# Altium schematic sheet Sheet1.SchDoc
size A2; SheetNumber: 1; SheetTotal: 1
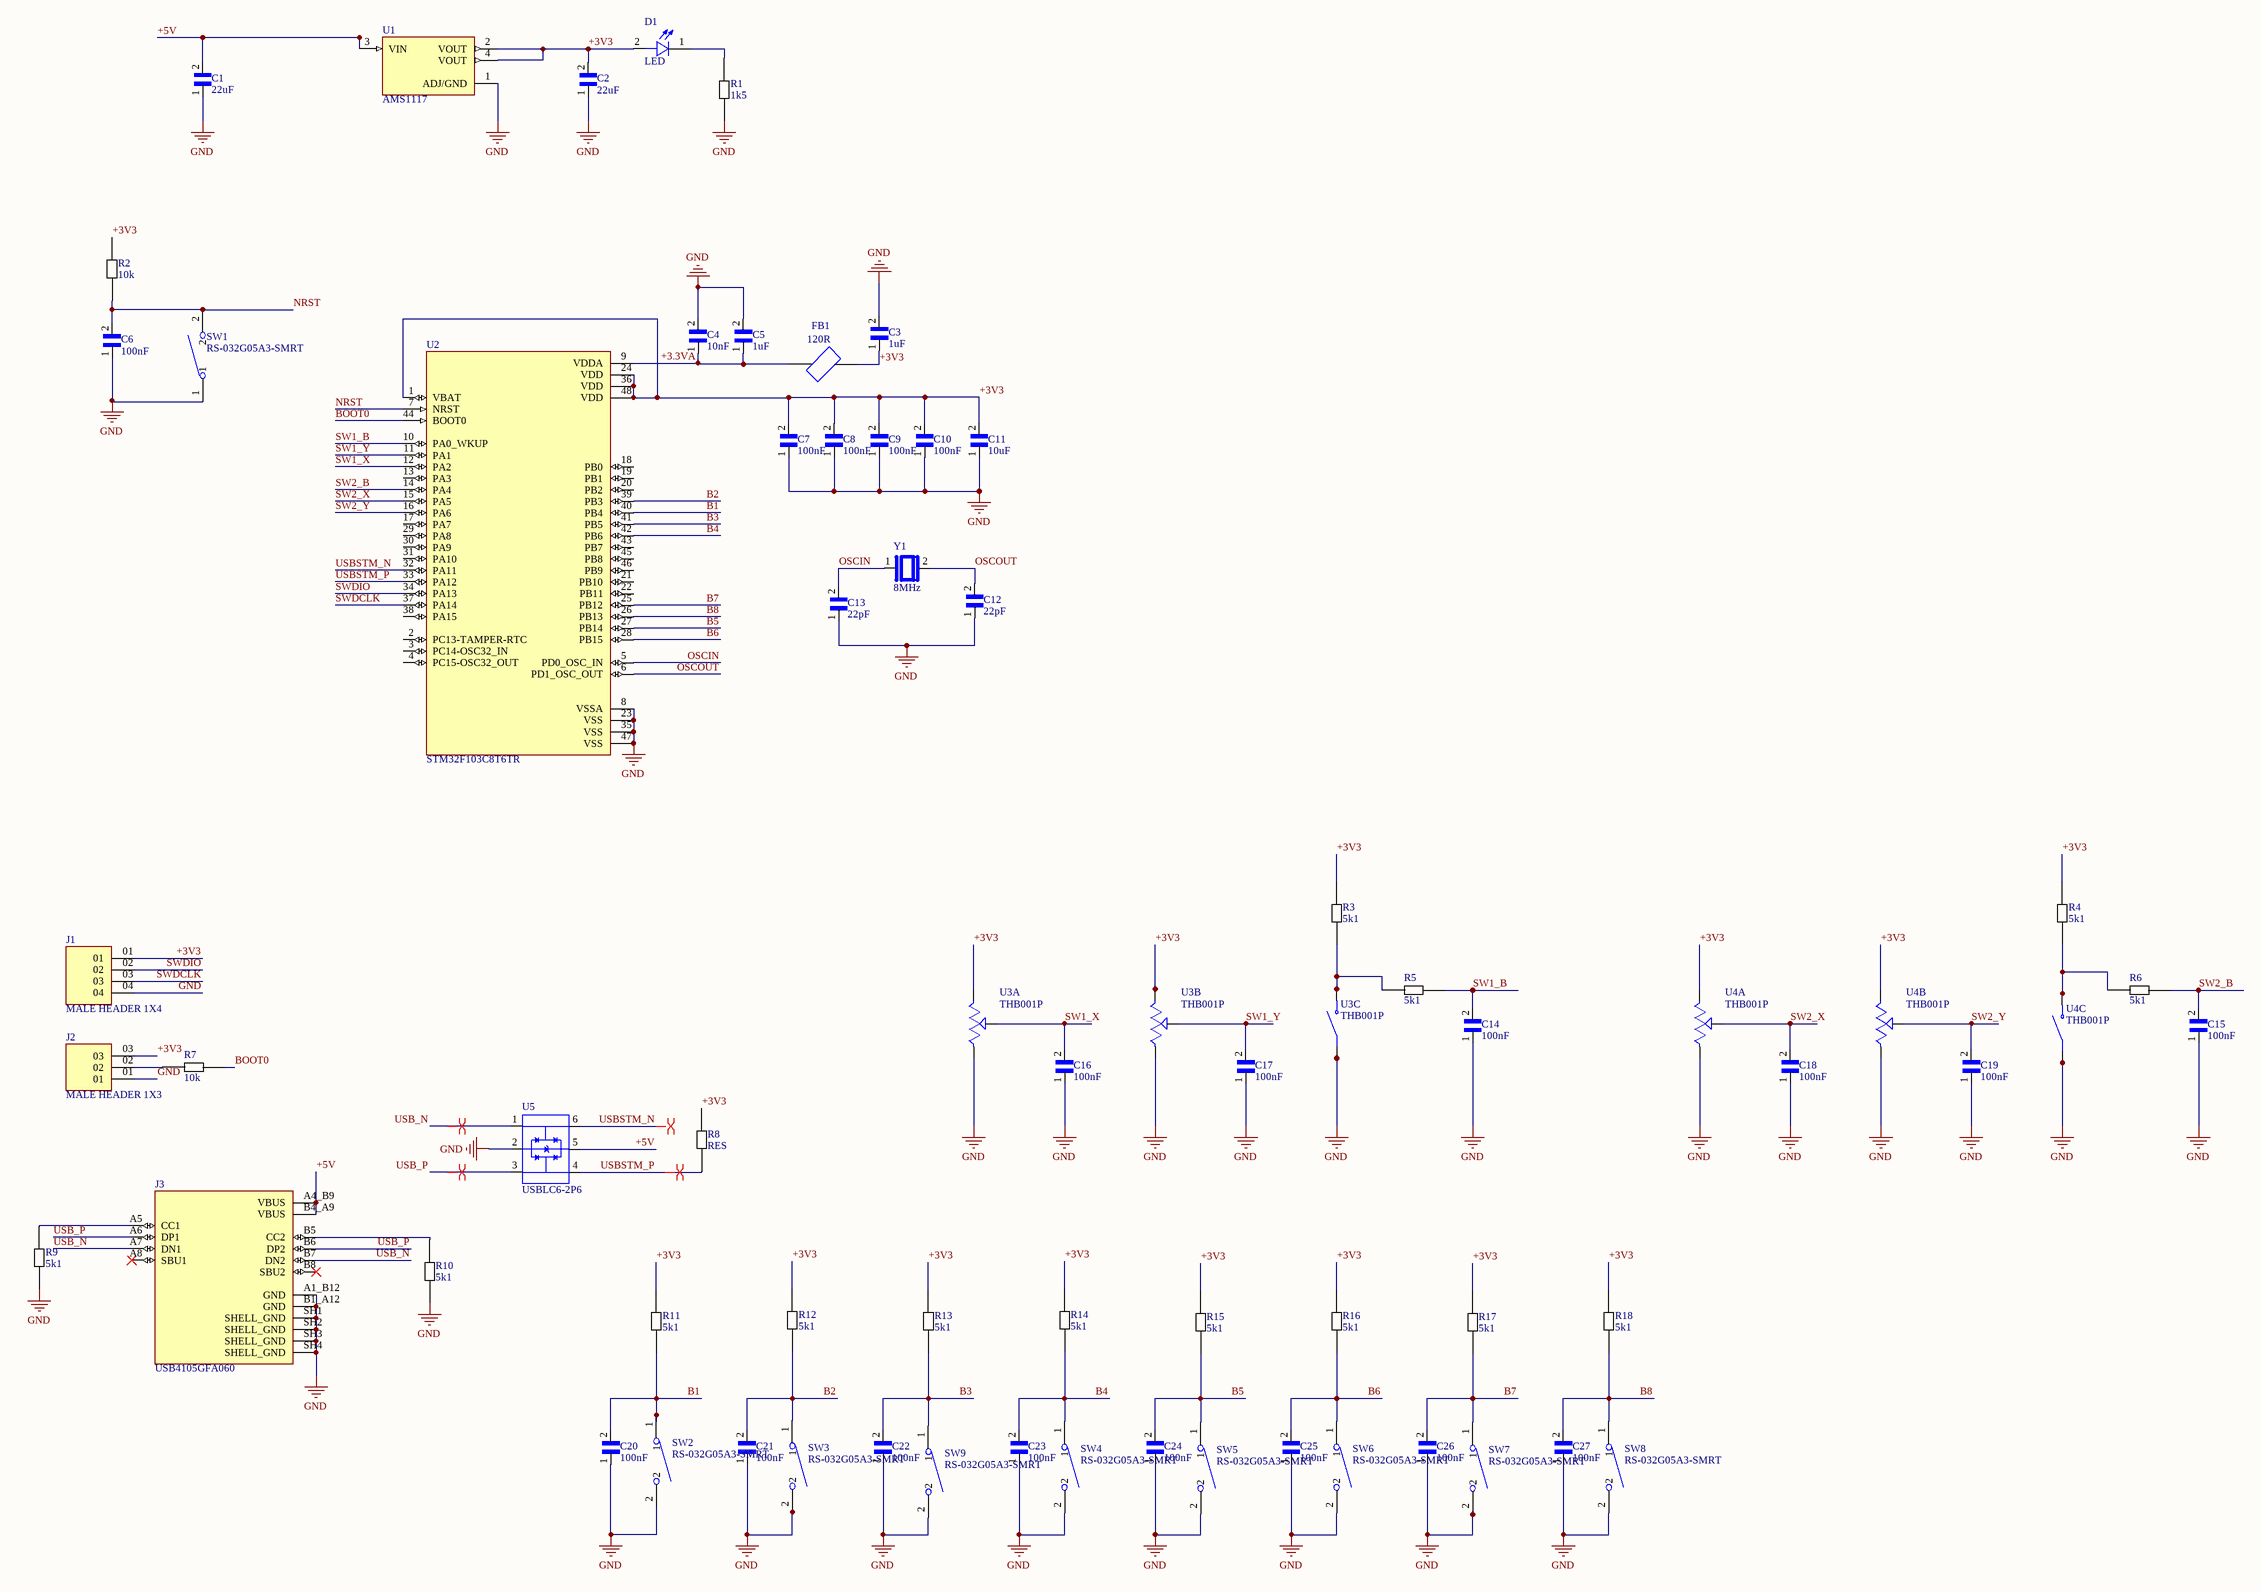
[diagram p0: Sheet1.SchDoc]

## Parts
C1  22uF  [CAPC2012X94N]
C2  22uF  [CAPC2012X94N]
C3  1uF  [CAPC2012X94N]
C4  10nF  [CAPC2012X94N]
C5  1uF  [CAPC2012X94N]
C6  100nF  [CAPC2012X94N]
C7  100nF  [CAPC2012X94N]
C8  100nF  [CAPC2012X94N]
C9  100nF  [CAPC2012X94N]
C10  100nF  [CAPC2012X94N]
C11  10uF  [CAPC2012X94N]
C12  22pF  [CAPC2012X94N]
C13  22pF  [CAPC2012X94N]
C14  100nF  [CAPC2012X94N]
C15  100nF  [CAPC2012X94N]
C16  100nF  [CAPC2012X94N]
C17  100nF  [CAPC2012X94N]
C18  100nF  [CAPC2012X94N]
C19  100nF  [CAPC2012X94N]
C20  100nF  [CAPC2012X94N]
C21  100nF  [CAPC2012X94N]
C22  100nF  [CAPC2012X94N]
C23  100nF  [CAPC2012X94N]
C24  100nF  [CAPC2012X94N]
C25  100nF  [CAPC2012X94N]
C26  100nF  [CAPC2012X94N]
C27  100nF  [CAPC2012X94N]
D1  LED  [LED_V0805-SMD-R (Red)]
FB1  120R  [FB_MI0805K400R-10]
J1  MALE HEADER 1X4  [SAMTEC_MTLW-104-X-X-S-X]
J2  MALE HEADER 1X3  [SAMTEC_MTLW-103-XX-XX-S-XXX]
J3  USB4105GFA060  [GCT_USB4105GFA060]
R1  1k5  [RESC2012X60N]
R2  10k  [RESC2012X60N]
R3  5k1  [RESC2012X60N]
R4  5k1  [RESC2012X60N]
R5  5k1  [RESC2012X60N]
R6  5k1  [RESC2012X60N]
R7  10k  [RESC2012X60N]
R8  RES  [RESC2012X60N]
R9  5k1  [RESC2012X60N]
R10  5k1  [RESC2012X60N]
R11  5k1  [RESC2012X60N]
R12  5k1  [RESC2012X60N]
R13  5k1  [RESC2012X60N]
R14  5k1  [RESC2012X60N]
R15  5k1  [RESC2012X60N]
R16  5k1  [RESC2012X60N]
R17  5k1  [RESC2012X60N]
R18  5k1  [RESC2012X60N]
SW1  RS-032G05A3-SMRT  [SW_RS-032G05A3-SMRT]
SW2  RS-032G05A3-SMRT  [SW_RS-032G05A3-SMRT]
SW3  RS-032G05A3-SMRT  [SW_RS-032G05A3-SMRT]
SW4  RS-032G05A3-SMRT  [SW_RS-032G05A3-SMRT]
SW5  RS-032G05A3-SMRT  [SW_RS-032G05A3-SMRT]
SW6  RS-032G05A3-SMRT  [SW_RS-032G05A3-SMRT]
SW7  RS-032G05A3-SMRT  [SW_RS-032G05A3-SMRT]
SW8  RS-032G05A3-SMRT  [SW_RS-032G05A3-SMRT]
SW9  RS-032G05A3-SMRT  [SW_RS-032G05A3-SMRT]
U1  AMS1117  [SOT229P700X180-4N]
U2  STM32F103C8T6TR  [QFP50P900X900X160-48N]
U3  THB001P  [CNK_THB001P]  (parts A,B,C of 3)
U4  THB001P  [CNK_THB001P]  (parts A,B,C of 3)
U5  USBLC6-2P6  [SOT50P160X60-6N]
Y1  8MHz  [XTAL_HC49P488W43L1150T466H350]

## Nets
GND: C1.1 C2.1 C3.2 C4.2 C5.2 C6.1 C7.1 C8.1 C9.1 C10.1 C11.1 C12.1 C13.1 C14.1 C15.1 C16.1 C17.1 C18.1 C19.1 C20.1 C21.1 C22.1 C23.1 C24.1 C25.1 C26.1 C27.1 J1.04 J2.01 J3.A1_B12(GND) J3.B1_A12(GND) J3.SH1(SHELL_GND) J3.SH2(SHELL_GND) J3.SH3(SHELL_GND) J3.SH4(SHELL_GND) R1.1 R9.1 R10.1 SW1.1 SW2.2 SW3.2 SW4.2 SW5.2 SW6.2 SW7.2 SW8.2 SW9.2 U1.1(ADJ/GND) U2.8(VSSA) U2.23(VSS) U2.35(VSS) U2.47(VSS) U3.C(COM) U3.D(COM) U3.VR1_1 U3.VR2_1 U4.C(COM) U4.D(COM) U4.VR1_1 U4.VR2_1 U5.2(GND)
+3.3VA: C4.1 C5.1 FB1.1 U2.9(VDDA)
+3V3: C2.2 C3.1 C7.2 C8.2 C9.2 C10.2 C11.2 D1.2(A) FB1.2 J1.01 J2.03 R2.2 R3.2 R4.2 R8.2 R11.2 R12.2 R13.2 R14.2 R15.2 R16.2 R17.2 R18.2 U1.2(VOUT) U1.4(VOUT) U2.1(VBAT) U2.24(VDD) U2.36(VDD) U2.48(VDD) U3.VR1_3 U3.VR2_3 U4.VR1_3 U4.VR2_3
+5V: C1.2 J3.A4_B9(VBUS) J3.B4_A9(VBUS) U1.3(VIN) U5.5(VBUS)
B1: C20.2 R11.1 SW2.1 U2.40(PB4)
B2: C21.2 R12.1 SW3.1 U2.39(PB3)
B3: C22.2 R13.1 SW9.1 U2.41(PB5)
B4: C23.2 R14.1 SW4.1 U2.42(PB6)
B5: C24.2 R15.1 SW5.1 U2.27(PB14)
B6: C25.2 R16.1 SW6.1 U2.28(PB15)
B7: C26.2 R17.1 SW7.1 U2.25(PB12)
B8: C27.2 R18.1 SW8.1 U2.26(PB13)
BOOT0: R7.2 U2.44(BOOT0)
NRST: C6.2 R2.1 SW1.2 U2.7(NRST)
OSCIN: C13.2 U2.5(PD0_OSC_IN) Y1.1
OSCOUT: C12.2 U2.6(PD1_OSC_OUT) Y1.2
SW1_B: C14.2 R5.1 U2.10(PA0_WKUP)
SW1_X: C16.2 U2.12(PA2) U3.VR1_2
SW1_Y: C17.2 U2.11(PA1) U3.VR2_2
SW2_B: C15.2 R6.1 U2.14(PA4)
SW2_X: C18.2 U2.15(PA5) U4.VR1_2
SW2_Y: C19.2 U2.16(PA6) U4.VR2_2
SWDCLK: J1.03 U2.37(PA14)
SWDIO: J1.02 U2.34(PA13)
USB_N: J3.A7(DN1) J3.B7(DN2) U5.1(I/O1_1)
USB_P: J3.A6(DP1) J3.B6(DP2) U5.3(I/O2_1)
USBSTM_N: U2.32(PA11) U5.6(I/O1_2)
USBSTM_P: R8.1 U2.33(PA12) U5.4(I/O2_2)
NetD1_1: D1.1(C) R1.2
NetJ2_02: J2.02 R7.1
NetJ3_A5: J3.A5(CC1) R9.2
NetJ3_B5: J3.B5(CC2) R10.2
NetR3_1: R3.1 R5.2 U3.A(NO) U3.B(NO)
NetR4_1: R4.1 R6.2 U4.A(NO) U4.B(NO)

Not connected (* = marked no-connect by the designer): J3 A8(SBU1)* B8(SBU2)*; U2 2(PC13-TAMPER-RTC) 3(PC14-OSC32_IN) 4(PC15-OSC32_OUT) 13(PA3) 17(PA7) 18(PB0) 19(PB1) 20(PB2) 21(PB10) 22(PB11) 29(PA8) 30(PA9) 31(PA10) 38(PA15) 43(PB7) 45(PB8) 46(PB9)

## Layout directives
differential pair: USB_N, USB_P, USBSTM_N, USBSTM_P

## Library data of the parts
C1-C27 = CAP: 10000pF Â±5% 16V Ceramic Capacitor X7R 0805 _2012 Metric_; MF: AVX; MP: 0805YC103J4T2A; Package: 2012 AVX; Availability: Unavailable; Value: *; SnapEDA_Link: https://www.snapeda.com/parts/0805YC103J4T2A/AVX/view-part/606803/?ref=snap; Price: None
D1 = LED: V0805 - Valcon 0805 Type Surface Mount LED; MP: V0805-SMD-R (Red); MF: Valcon; Price: None; Purchase-URL: https://pricing.snapeda.com/search/part/V0805-SMD-R (Red)/?ref=eda; SnapEDA_Link: https://www.snapeda.com/parts/V0805-SMD-R%20(Red)/Valcon/view-part/4780809/?ref=snap; Availability: No availability data; Value: *; Check_prices: https://www.snapeda.com/parts/V0805-SMD-R%20(Red)/Valcon/view-part/4780809/?ref=eda; Package: None
FB1 = FB: 40 Ohms @ 100MHz 1 Power Line Ferrite Bead 0805 (2012 Metric) 1.5A 50mOhm; MP: MI0805K400R-10; MF: Laird-Signal Integrity Products; Availability: Warning; SnapEDA_Link: https://www.snapeda.com/parts/MI0805K400R-10/Laird/view-part/4794545/?ref=snap; Value: *; Price: None; Package: 0805 Laird-Signal Integrity Products; Purchase-URL: https://pricing.snapeda.com/search/part/MI0805K400R-10/?ref=eda; Check_prices: https://www.snapeda.com/parts/MI0805K400R-10/Laird/view-part/4794545/?ref=eda
J1 = MALE HEADER 1X4: MF: {'manufacturer': u'Samtec Inc.'}; MP: MTLW-104-X-X-S-X; Package: None; Price: None; Value: *; Availability: Unavailable
J2 = MALE HEADER 1X3: Connector Header Through Hole 40 position 0.100" (2.54mm); MP: MTLW-103-XX-XX-S-XXX; Package: None; Price: None; Value: *; Availability: Unavailable
J3 = USB4105GFA060: MF: {'manufacturer': u'GCT'}; Package: None; Price: None; Value: *; MP: USB4105GFA060; Availability: Unavailable
R1-R18 = RES: 330 Ohms Â±1% 0.125W, 1/8W Chip Resistor 0805 _2012 Metric_ Moisture Resistant Thick Film; MP: RC0805FR-07330RL; MF: Yageo; Package: 2012 Rohm Semiconductor; Value: *; SnapEDA_Link: https://www.snapeda.com/parts/RC0805FR-07330RL/Yageo/view-part/106115/?ref=snap; Price: None; Availability: Unavailable
SW1-SW9 = RS-032G05A3-SMRT: Tactile Switch SPST-NO Top Actuated Surface Mount; MF: C&K; MP: RS032G05A3SMRT; Package: None; Value: *; Availability: Unavailable; SnapEDA_Link: https://www.snapeda.com/parts/RS032G05A3SMRT/C%26K/view-part/578384/?ref=snap; Price: None
U1 = AMS1117: 1A LOW DROPOUT VOLTAGE REGULATOR SOT-223; MF: Advanced Monolithic Systems; Price: None; Availability: Not in stock; Package: SOT-223 Seeed Technology; MP: AMS1117; Value: *; SnapEDA_Link: https://www.snapeda.com/parts/AMS1117/Advanced+Monolithic+Systems/view-part/?ref=snap; Check_prices: https://www.snapeda.com/parts/AMS1117/Advanced+Monolithic+Systems/view-part/?ref=eda
U2 = STM32F103C8T6TR: Mainstream Performance line, ARM Cortex-M3 MCU with 64 Kbytes Flash, 72 MHz CPU, motor control, USB and CAN; MF: {'manufacturer': u'STMicroelectronics'}; Package: None; Price: None; Value: *; MP: STM32F103C8T6TR; Availability: Unavailable
U3 U4 = THB001P: Joystick, 2 - Axis Analog (Resistive) Output; MF: C&K; Price: None; Availability: In Stock; MP: THB001P; Package: None; SnapEDA_Link: https://www.snapeda.com/parts/THB001P/C%2526K/view-part/?ref=snap; Check_prices: https://www.snapeda.com/parts/THB001P/C%2526K/view-part/?ref=eda; Value: *; Purchase-URL: https://pricing.snapeda.com/search/part/THB001P/?ref=eda
U5 = USBLC6-2P6: 17V Clamp 5A _8/20Âµs_ Ipp Tvs Diode Surface Mount SOT-666; MF: STMicroelectronics; Value: *; MP: USBLC6-2P6; SnapEDA_Link: https://www.snapeda.com/parts/USBLC6-2P6/STMicroelectronics/view-part/106846/?ref=snap; Availability: Unavailable; Price: None; Package: SOT-563 STMicroelectronics
Y1 = HC-49/U-S16000000ABJB: 16 MHz Â±30ppm Crystal 18pF 50 Ohms HC-49/US; MF: Citizen Finedevice Co Ltd; Value: *; SnapEDA_Link: https://www.snapeda.com/parts/HC-49/U-S16000000ABJB/Citizen+Finedevice+Co+Ltd/view-part/?ref=snap; Purchase-URL: https://pricing.snapeda.com/search/part/HC-49/U-S16000000ABJB/?ref=eda; Availability: In Stock; Price: None; Package: HC-49/US Citizen Finetech Miyota; Check_prices: https://www.snapeda.com/parts/HC-49/U-S16000000ABJB/Citizen+Finedevice+Co+Ltd/view-part/?ref=eda; MP: HC-49/U-S16000000ABJB